# Altium schematic sheet Sheet1.SchDoc
size A3
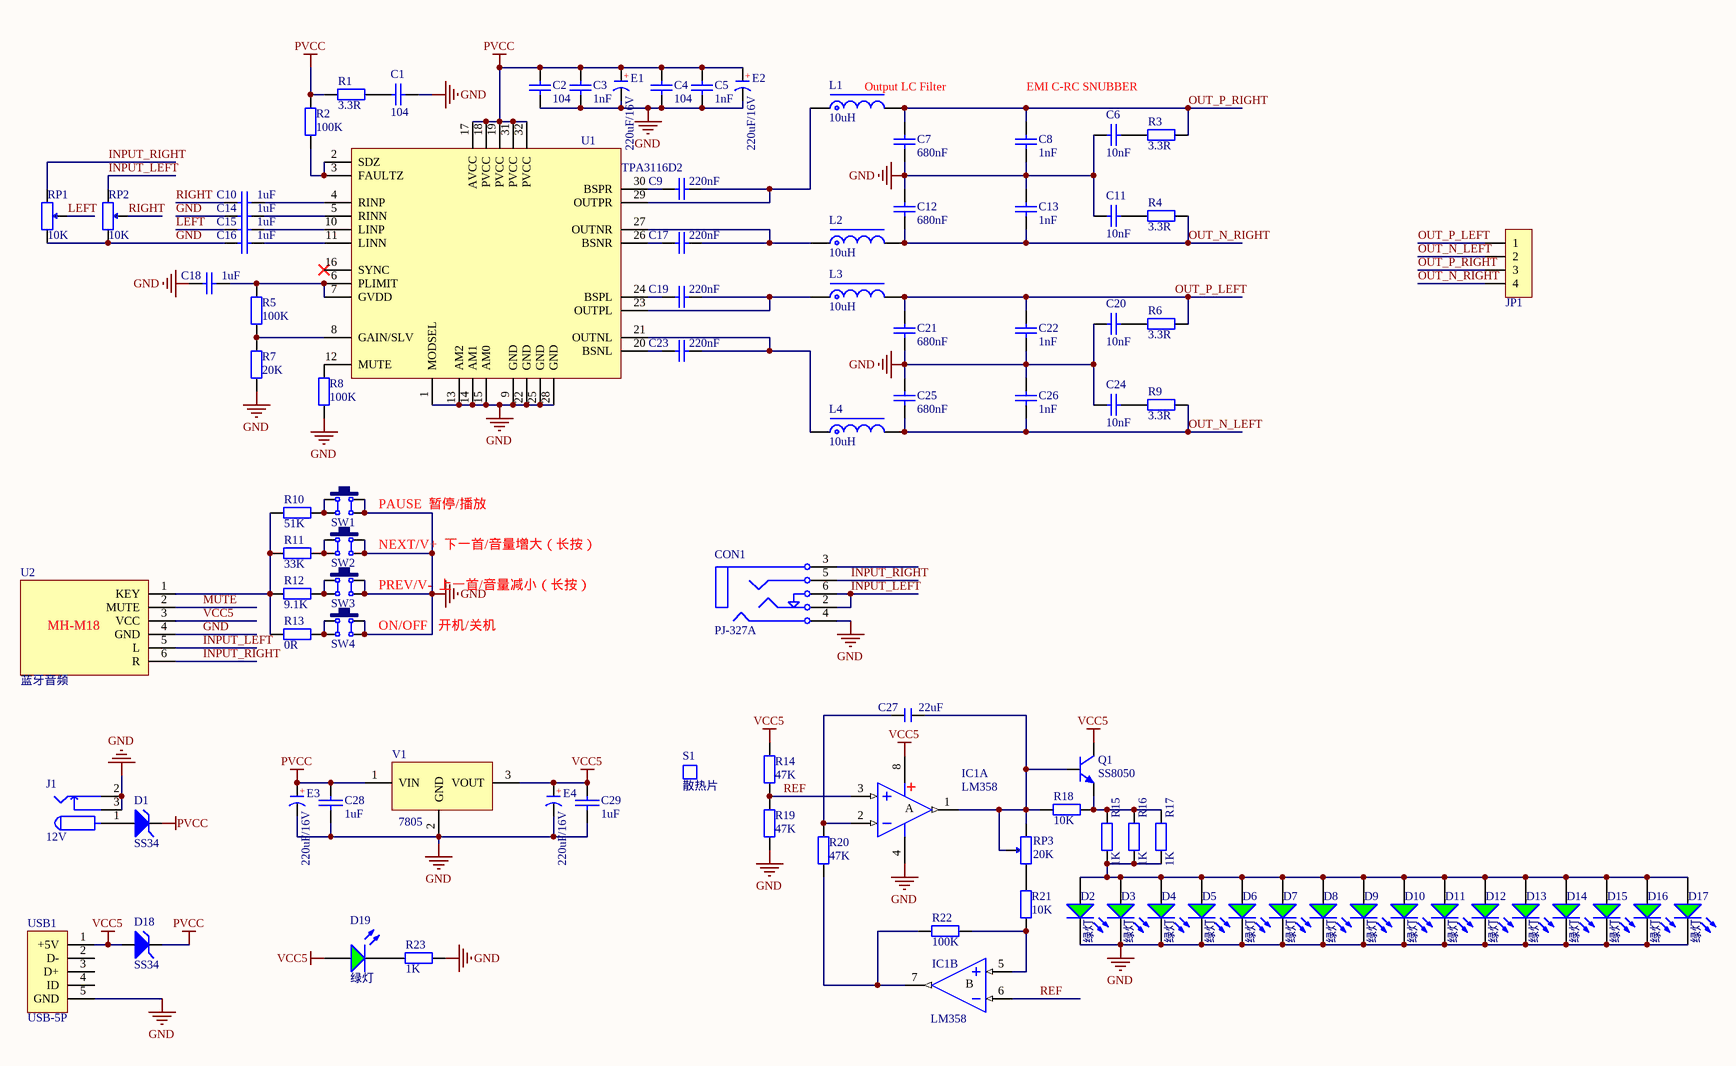
[diagram p0: Sheet1.SchDoc]

## Parts
C1  104  [LC-0603_C]
C2  104  [LC-0603_C]
C3  1nF  [LC-0603_C]
C4  104  [LC-0603_C]
C5  1nF  [LC-0603_C]
C6  10nF  [LC-0603_C]
C7  680nF  [LC-0603_C]
C8  1nF  [LC-0603_C]
C9  220nF  [LC-0603_C]
C10  1uF  [LC-0603_C]
C11  10nF  [LC-0603_C]
C12  680nF  [LC-0603_C]
C13  1nF  [LC-0603_C]
C14  1uF  [LC-0603_C]
C15  1uF  [LC-0603_C]
C16  1uF  [LC-0603_C]
C17  220nF  [LC-0603_C]
C18  1uF  [LC-0603_C]
C19  220nF  [LC-0603_C]
C20  10nF  [LC-0603_C]
C21  680nF  [LC-0603_C]
C22  1nF  [LC-0603_C]
C23  220nF  [LC-0603_C]
C24  10nF  [LC-0603_C]
C25  680nF  [LC-0603_C]
C26  1nF  [LC-0603_C]
C27  22uF  [C 1210_M]
C28  1uF  [LC-0603_C]
C29  1uF  [LC-0603_C]
CON1  PJ-327A  [PJ-327A]
D1  SS34  [D1812]
D2  绿灯  [LC-0603_LED_S1]
D3  绿灯  [LC-0603_LED_S1]
D4  绿灯  [LC-0603_LED_S1]
D5  绿灯  [LC-0603_LED_S1]
D6  绿灯  [LC-0603_LED_S1]
D7  绿灯  [LC-0603_LED_S1]
D8  绿灯  [LC-0603_LED_S1]
D9  绿灯  [LC-0603_LED_S1]
D10  绿灯  [LC-0603_LED_S1]
D11  绿灯  [LC-0603_LED_S1]
D12  绿灯  [LC-0603_LED_S1]
D13  绿灯  [LC-0603_LED_S1]
D14  绿灯  [LC-0603_LED_S1]
D15  绿灯  [LC-0603_LED_S1]
D16  绿灯  [LC-0603_LED_S1]
D17  绿灯  [LC-0603_LED_S1]
D18  SS34  [D1812]
D19  绿灯  [LC-0603_LED_S1]
E1  220uF/16V  [CAP 5.0*10*12.5 - BK]
E2  220uF/16V  [CAP 5.0*10*12.5 - BK]
E3  220uF/16V  [CAP 5.0*10*12.5 - BK]
E4  220uF/16V  [CAP 5.0*10*12.5 - BK]
IC1  LM358  [SOP8_M]  (parts A,B of 2)
J1  12V  [DC10B]
JP1  HDR-1X4  [KF128-5.08-4P]  (value not drawn)
L1  10uH  [CD105]
L2  10uH  [CD105]
L3  10uH  [CD105]
L4  10uH  [CD105]
Q1  SS8050  [SOT23-3L]
R1  3.3R  [LC-0603_R]
R2  100K  [LC-0603_R]
R3  3.3R  [LC-0603_R]
R4  3.3R  [LC-0603_R]
R5  100K  [LC-0603_R]
R6  3.3R  [LC-0603_R]
R7  20K  [LC-0603_R]
R8  100K  [LC-0603_R]
R9  3.3R  [LC-0603_R]
R10  51K  [LC-0603_R]
R11  33K  [LC-0603_R]
R12  9.1K  [LC-0603_R]
R13  0R  [LC-0603_R]
R14  47K  [LC-0603_R]
R15  1K  [LC-0603_R]
R16  1K  [LC-0603_R]
R17  1K  [LC-0603_R]
R18  10K  [LC-0603_R]
R19  47K  [LC-0603_R]
R20  47K  [LC-0603_R]
R21  10K  [LC-0603_R]
R22  100K  [LC-0603_R]
R23  1K  [LC-0603_R]
RP1  10K  [RV0931]
RP2  10K  [RV0931]
RP3  20K  [RM065]
S1  散热片  [SRP10-15-21-P]
SW1  6x6x5  [TSW DIP-6*6*12]  (value not drawn)
SW2  6x6x5  [TSW DIP-6*6*12]  (value not drawn)
SW3  6x6x5  [TSW DIP-6*6*12]  (value not drawn)
SW4  6x6x5  [TSW DIP-6*6*12]  (value not drawn)
U1  TPA3116D2  [HTSSOP-32]
U2  蓝牙音频  [MH-M18蓝牙模块]
USB1  USB-5P  [USB-MICRO_A]
V1  7805  [TO220A]

## Nets
GND: C1.2 C2.2 C3.2 C4.2 C5.2 C6.1 C7.2 C8.2 C11.1 C12.1 C13.1 C14.1 C16.1 C18.1 C20.1 C21.2 C22.2 C24.1 C25.1 C26.1 C28.1 C29.1 CON1.4 D2.K D3.K D4.K D5.K D6.K D7.K D8.K D9.K D10.K D11.K D12.K D13.K D14.K D15.K D16.K D17.K E1.2(K) E2.2(K) E3.2(K) E4.2(K) IC1.4(V-) J1.2 J1.3 R7.1 R8.1 R19.2 R23.2 RP1.3 RP2.3 SW1.2 SW1.3 SW2.2 SW2.3 SW3.2 SW3.3 SW4.2 SW4.3 U1.1(MODSEL) U1.9(GND) U1.13(AM2) U1.14(AM1) U1.15(AM0) U1.22(GND) U1.25(GND) U1.28(GND) U2.4(GND) USB1.5(GND) V1.2(GND)
PVCC: C2.1 C3.1 C4.1 C5.1 C28.2 D1.2(K) D18.2(K) E1.1(A) E2.1(A) E3.1(A) R1.1 R2.2 U1.17(AVCC) U1.18(PVCC) U1.19(PVCC) U1.31(PVCC) U1.32(PVCC) V1.1(VIN)
VCC5: C29.2 D18.1(A) D19.A E4.1(A) IC1.8(V+) Q1.3(C) R14.1 U2.3(VCC) USB1.1(+5V) V1.3(VOUT)
INPUT_LEFT: CON1.2 CON1.6 RP2.1 U2.5(L)
INPUT_RIGHT: CON1.5 RP1.1 U2.6(R)
LEFT: C15.1 RP1.2
MUTE: U2.2(MUTE)
OUT_N_LEFT: C25.2 C26.2 JP1.2 L4.2 R9.2
OUT_N_RIGHT: C12.2 C13.2 JP1.4 L2.2 R4.2
OUT_P_LEFT: C21.1 C22.1 JP1.1 L3.2 R6.2
OUT_P_RIGHT: C7.1 C8.1 JP1.3 L1.2 R3.2
REF: IC1.3(IN+) IC1.6(IN-) R14.2 R19.1
RIGHT: C10.1 RP2.2
NetC1_1: C1.1 R1.2
NetC6_2: C6.2 R3.1
NetC9_1: C9.1 U1.30(BSPR)
NetC9_2: C9.2 L1.1 U1.29(OUTPR)
NetC10_2: C10.2 U1.4(RINP)
NetC11_2: C11.2 R4.1
NetC14_2: C14.2 U1.5(RINN)
NetC15_2: C15.2 U1.10(LINP)
NetC16_2: C16.2 U1.11(LINN)
NetC17_1: C17.1 U1.26(BSNR)
NetC17_2: C17.2 L2.1 U1.27(OUTNR)
NetC18_2: C18.2 R5.2 U1.6(PLIMIT) U1.7(GVDD)
NetC19_1: C19.1 U1.24(BSPL)
NetC19_2: C19.2 L3.1 U1.23(OUTPL)
NetC20_2: C20.2 R6.1
NetC23_1: C23.1 U1.20(BSNL)
NetC23_2: C23.2 L4.1 U1.21(OUTNL)
NetC24_2: C24.2 R9.1
NetC27_1: C27.1 IC1.2(IN-) R20.1
NetC27_2: C27.2 IC1.1(OUT) Q1.1(B) R18.1 RP3.2 RP3.3
NetD1_1: D1.1(A) J1.1
NetD2_A: D2.A D3.A D4.A D5.A D6.A D7.A D8.A D9.A D10.A D11.A D12.A D13.A D14.A D15.A D16.A D17.A R15.2 R16.2 R17.2
NetD19_K: D19.K R23.1
NetIC1_5: IC1.5(IN+) R21.2 R22.2
NetIC1_7: IC1.7(OUT) R20.2 R22.1
NetQ1_2: Q1.2(E) R15.1 R16.1 R17.1 R18.2
NetR2_1: R2.1 U1.2(SDZ) U1.3(FAULTZ)
NetR5_1: R5.1 R7.2 U1.8(GAIN/SLV)
NetR8_2: R8.2 U1.12(MUTE)
NetR10_1: R10.1 SW1.1 SW1.4
NetR10_2: R10.2 R11.2 R12.2 R13.2 U2.1(KEY)
NetR11_1: R11.1 SW2.1 SW2.4
NetR12_1: R12.1 SW3.1 SW3.4
NetR13_1: R13.1 SW4.1 SW4.4
NetR21_1: R21.1 RP3.1

Not connected (* = marked no-connect by the designer): CON1 3; U1 16(SYNC)*; USB1 2(D-) 3(D+) 4(ID)

## Notes on the sheet
- (near L1) Output LC Filter
- EMI C-RC SNUBBER
- PAUSE  暂停/播放
- NEXT/V+  下一首/音量增大（长按）
- PREV/V-  上一首/音量减小（长按）
- ON/OFF   开机/关机
- (in symbol C-CAP) +
- (in symbol LM358, part A) A
- (in symbol LM358, part B) B
- (in symbol 蓝牙音频接收器模块) MH-M18

## Library data of the parts
C1-C26 = 0603 1nF (102) 10% 50V: 贴片电容; ComponentLink1Description: 供应商链接; ComponentLink1URL: http://www.szlcsc.com/product/details_1940.html; Package: 0603; Supplier: LC; SuppliersPartNumber: C1588
C27 = C: 无极性贴片电容; 版权归属: 源创客; BOM名称: 无极性贴片电容; 学习资源: www.ooocke.com
C28 C29 = 0805C: Capacitor 0805
CON1 = PJ-327A: 3.5mm耳机插座
D1 D18 = 1N5822: Zener Diode
D2-D17 D19 = 0603 绿灯: 发光二极管; ComponentLink1Description: 供应商链接; ComponentLink1URL: http://www.szlcsc.com/product/details_73152.html; Package: 0603; Supplier: LC; SuppliersPartNumber: C72043
E1-E4 = C-CAP: 直插电解电容; 版权归属: 源创客; BOM名称: 直插电解电容; 学习资源: www.ooocke.com
IC1 = LM358: 双路运放; 版权归属: 源创客; BOM名称: 双路运放; 学习资源: www.ooocke.com
J1 = POW
JP1 = Header 4: 4P接插件; 版权归属: 源创客; BOM名称: 4P接插件; 学习资源: www.ooocke.com
L1-L4 = L-CD: 贴片功率电感; BOM名称: 功率电感; 版权归属: 源创客; 学习资源: www.ooocke.com
Q1 = 8050-SMD: 高频放大-NPN型; 版权归属: 源创客; 属性: 40V 1.5A 1W 100MHZ; BOM名称: 高频放大-NPN型; 学习资源: www.ooocke.com
R1-R13 = 0603 1Ω (1R00) 1%: 贴片电阻; ComponentLink1Description: 供应商链接; ComponentLink1URL: http://www.szlcsc.com/product/details_23663.html; Package: 0603; Supplier: LC; SuppliersPartNumber: C22936
R14 R18-R22 = Res1: 贴片电阻; Value: 1K; Published: 8-Jun-2000; LatestRevisionDate: 17-Jul-2002; LatestRevisionNote: Re-released for DXP Platform.; PackageReference: AXIAL-0.4; Publisher: Altium Limited
R15-R17 R23 = Res1: 贴片电阻; Published: 8-Jun-2000; LatestRevisionDate: 17-Jul-2002; LatestRevisionNote: Re-released for DXP Platform.; PackageReference: AXIAL-0.4; Publisher: Altium Limited; Value: 1K
RP1-RP3 = RP-ID: 插件单联电位器; BOM名称: 插件电位器; 版权归属: 源创客; 学习资源: www.ooocke.com
S1 = S1: 版权归属: 源创客; BOM名称: 散热片; 学习资源: www.ooocke.com
SW1-SW4 = TSW DIP-6x6: 直插6x6轻触开关; 版权归属: 源创客; BOM名称: 直插6x6轻触开关; 学习资源: www.ooocke.com
U2 = 蓝牙音频接收器模块
USB1 = USB-5P: 微型USB母座; 版权归属: 源创客; BOM名称: 微型USB母座; 学习资源: www.ooocke.com
V1 = 78xx: 线性稳压芯片; 版权归属: 源创客; BOM名称: 线性稳压芯片; 学习资源: www.ooocke.com